# EAGLE design SparkFun_LMD1820x-Breakout-V12 (EAGLE 7.2.0)
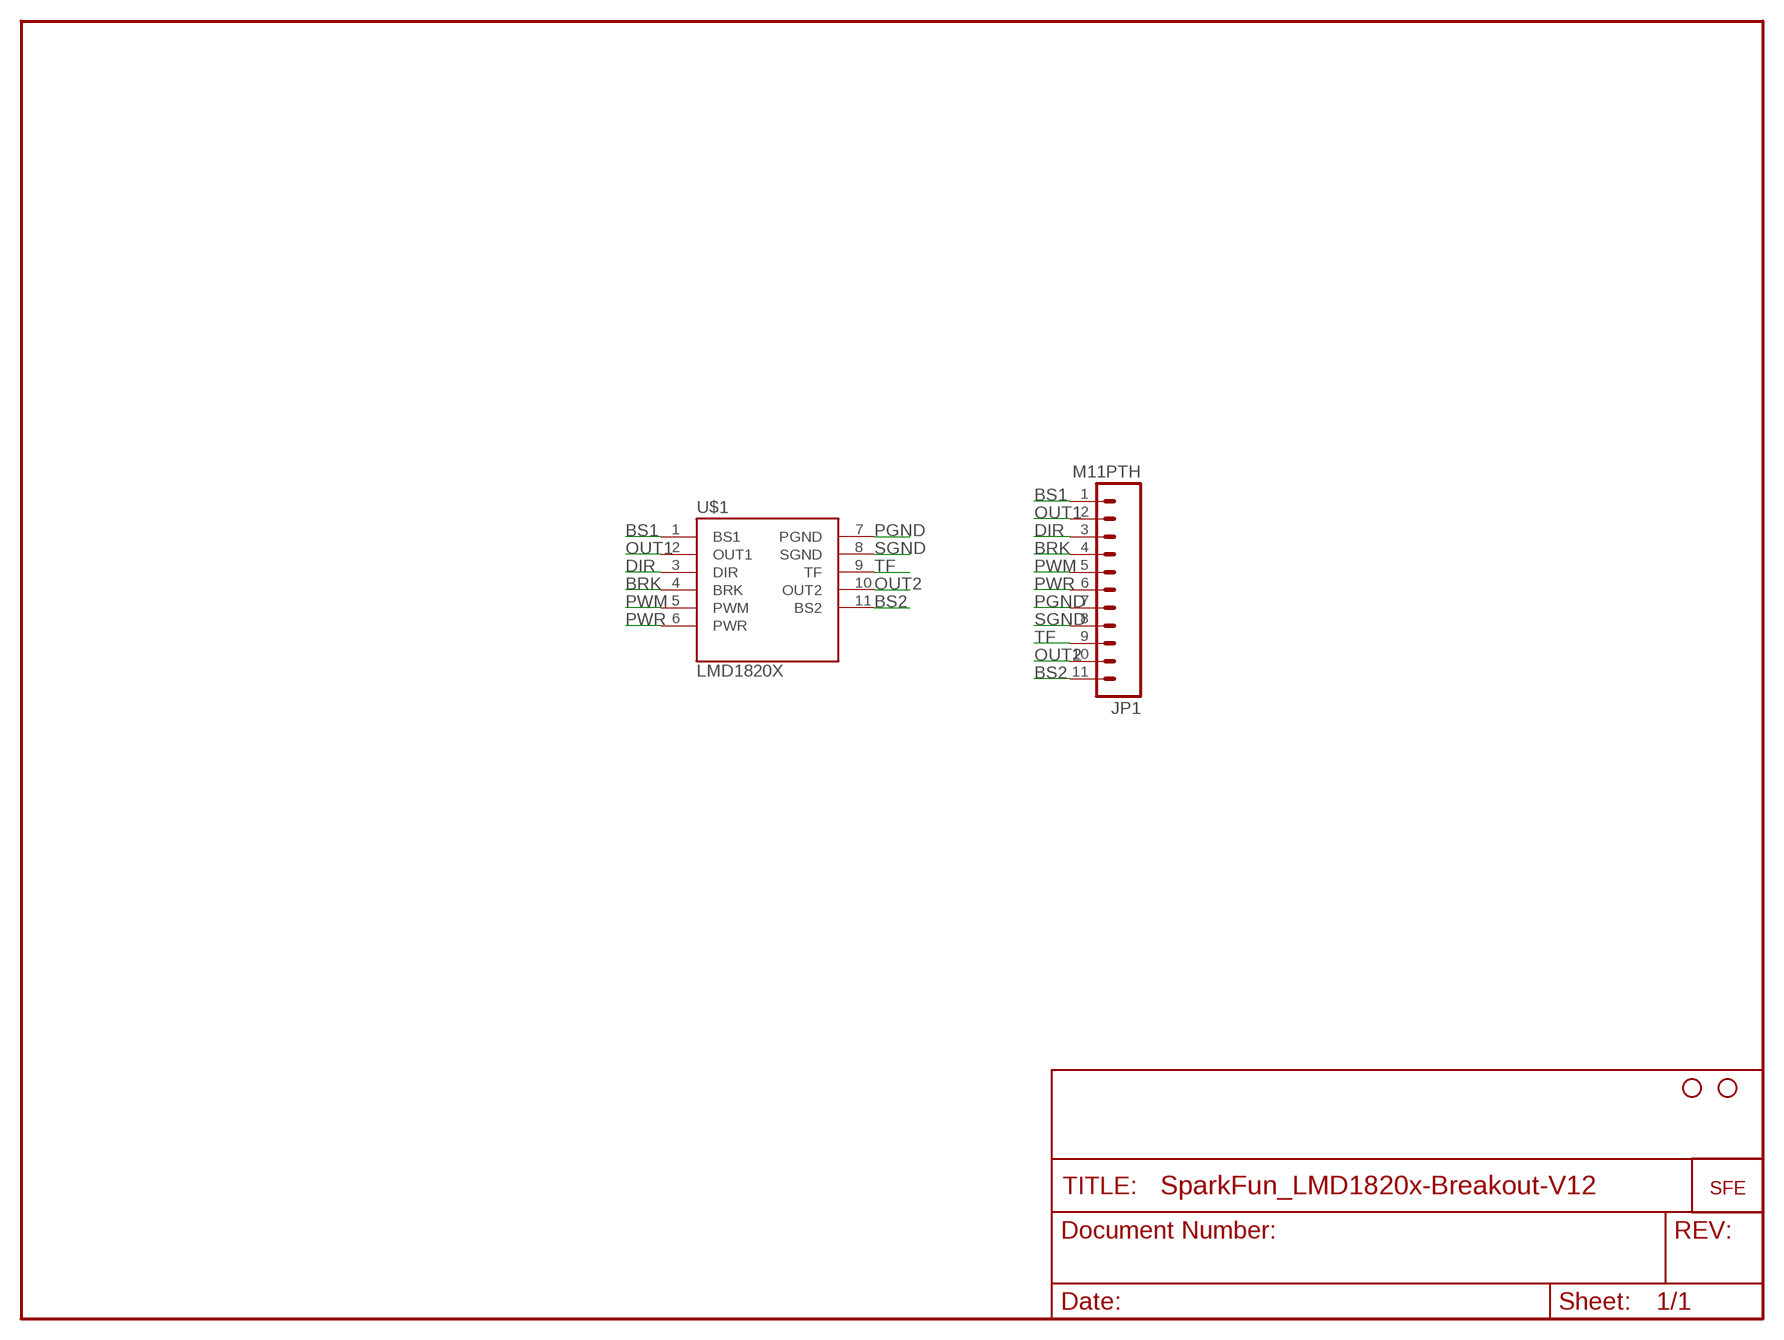
[diagram p0: schematic, sheet 1]

## Parts
JP1  M11PTH  [1X11]
JP2  STAND-OFF  [STAND-OFF]
JP3  STAND-OFF  [STAND-OFF]
JP5  LOGO-SFENEW  [SFE-NEW-WEBLOGO]
U$1  LMD1820X  [TO-220-11LEAD]

## Nets
BRK: JP1.4 U$1.4(BRK)
BS1: JP1.1 U$1.1(BS1)
BS2: JP1.11 U$1.11(BS2)
DIR: JP1.3 U$1.3(DIR)
OUT1: JP1.2 U$1.2(OUT1)
OUT2: JP1.10 U$1.10(OUT2)
PGND: JP1.7 U$1.7(PGND)
PWM: JP1.5 U$1.5(PWM)
PWR: JP1.6 U$1.6(PWR)
SGND: JP1.8 U$1.8(SGND)
TF: JP1.9 U$1.9(TF)

## Library data of the parts
JP1 = SparkFun:M11: Header 11 Standard 11-pin 0.1" header. Use with straight break away headers (SKU : PRT-00116), right angle break away headers (PRT-00553), swiss pins (PRT-00743), machine pins (PRT-00117), and female headers (PRT-00115).
JP2 JP3 = SparkFun:STAND-OFF: Stand Off This is the mechanical footprint for a #4 phillips button head screw. Use the keepout ring to avoid running the screw head into surrounding components. SKU : PRT-00447
JP5 = SparkFun:LOGO-SFE: Spark Fun Electronics PCB Logo This is the standard Spark Fun Electronics PCB logo.
U$1 = SparkFun:LMD1820X: LMD1820X H-Bridge - BOB-00747

## Board
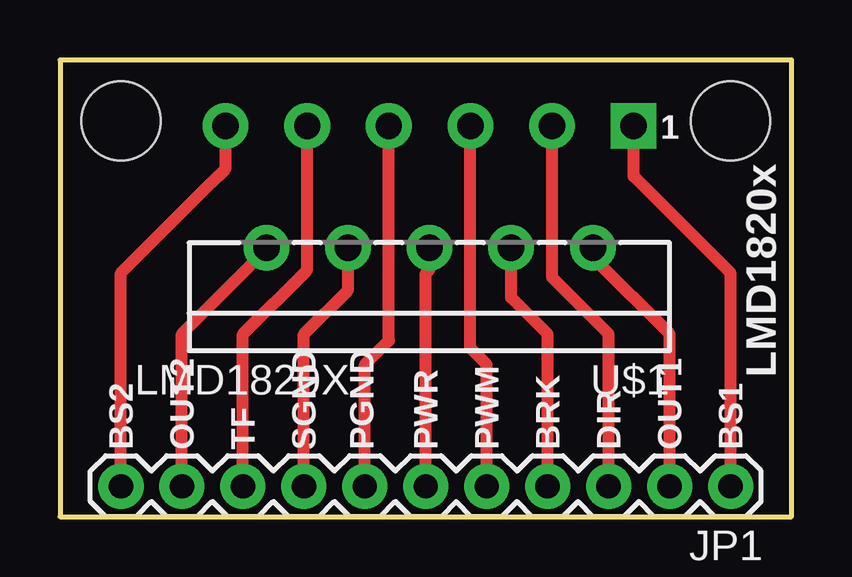
[diagram p1: board, top side]
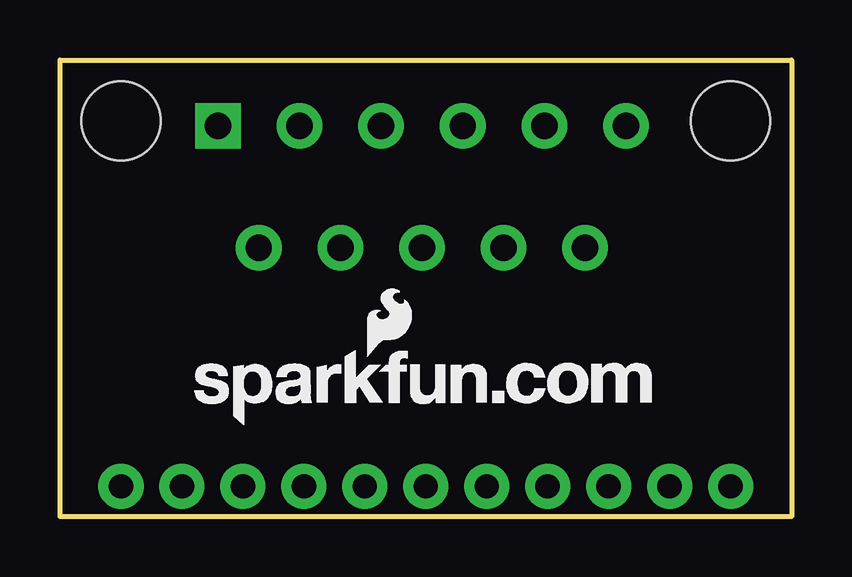
[diagram p2: board, bottom side, seen from below]

Size 30.48 x 19.05 mm. Coordinates in mm from the lower left corner, seen from the top.
Outline: 0,0 30.48,0 30.48,19.05 0,19.05 0,0
Copper layers (1*16): Top 0.0356mm / dielectric 1.5011mm / Bottom 0.0356mm
Design rules "default": minimum track width 8mil, minimum drill 20mil, track to track 8mil, track to pad 8mil, pad to pad 8mil, via to via 8mil, smd to smd 8mil, copper to edge 10mil, drill to drill 8mil, minimum pad ring 12mil, minimum via ring 10mil, stop-mask expansion 4mil, vias tented up to drill 20mil, thermal gap 10mil

### Footprints (pad centres in the part's own frame; a part is rotated, then mirrored left to right if it is on the bottom)
1X11 = drill 1.016 pad 1.88: 1 0,0; 2 2.54,0; 3 5.08,0; 4 7.62,0; 5 10.16,0; 6 12.7,0; 7 15.24,0; 8 17.78,0; 9 20.32,0; 10 22.86,0; 11 25.4,0
STAND-OFF = hole 3.302: 0,0
TO-220-11LEAD = drill 1.1 pad 1.9 square: 1 1.5,-4.87 | drill 1.1 pad 1.9: 2 3.2,0.21; 3 4.9,-4.87; 4 6.6,0.21; 5 8.3,-4.87; 6 10,0.21; 7 11.7,-4.87; 8 13.4,0.21; 9 15.1,-4.87; 10 16.8,0.21; 11 18.5,-4.87

### Placement (x,y rotation side)
JP1  27.94,1.27 180 top
JP2  2.54,16.51 0 top
JP3  27.94,16.51 0 top
JP5  24.89,3.81 0 bottom
U$1  25.4,11.43 180 top

### Tracks (layer width: path | path; a pad name or v marks a point on that pad's centre or on a via)
BRK
  Top 0.508: U$1.4 18.8,9.14 20.32,7.62 JP1.4
BS1
  Top 0.508: U$1.1 23.9,14.2 27.94,10.16 JP1.1
BS2
  Top 0.508: 6.35,13.97 2.54,10.16 JP1.11 | 6.35,13.97 6.77,14.39 | U$1.11 6.9,14.52 6.35,13.97
DIR
  Top 0.508: U$1.3 20.5,9.98 22.86,7.62 JP1.3
OUT1
  Top 0.508: 22.2,11.2 U$1.2 22.2,10.82 25.4,7.62 JP1.2
OUT2
  Top 0.508: U$1.10 8.6,11.14 5.08,7.62 JP1.10
PGND
  Top 0.508: JP1.7 12.7,6.35 13.7,7.35 U$1.7
PWM
  Top 0.508: JP1.5 17.78,6.35 17.1,7.03 U$1.5
PWR
  Top 0.508: U$1.6 15.4,10.32 15.24,10.16 JP1.6
SGND
  Top 0.508: U$1.8 12,9.46 10.16,7.62 JP1.8
TF
  Top 0.508: U$1.9 10.3,10.3 7.62,7.62 JP1.9

### Text on the board
tPlace: 1 | LMD1820x | BS2 | OUT2 | TF | SGND | PGND | PWR | PWM | BRK | DIR | OUT1 | BS1